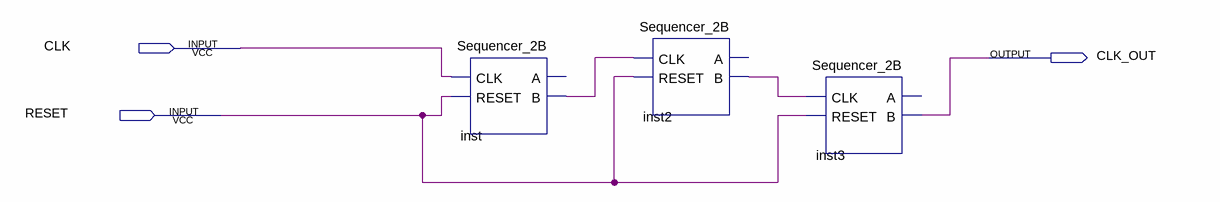
[diagram p0: schematic sheet]
// Quartus schematic Clock_Divider_64.bdf as structural Verilog: 3 symbols, 3 pins
module Clock_Divider_64 (
  input  CLK,
  input  RESET,
  output CLK_OUT
);

  wire inst2_b, inst_b;

  Sequencer_2B inst (.CLK(CLK), .RESET(RESET), .B(inst_b));  // open: A
  Sequencer_2B inst2 (.CLK(inst_b), .RESET(RESET), .B(inst2_b));  // open: A
  Sequencer_2B inst3 (.CLK(inst2_b), .RESET(RESET), .B(CLK_OUT));  // open: A
endmodule
